# EAGLE design Arduino Nano2 (EAGLE 5.11)
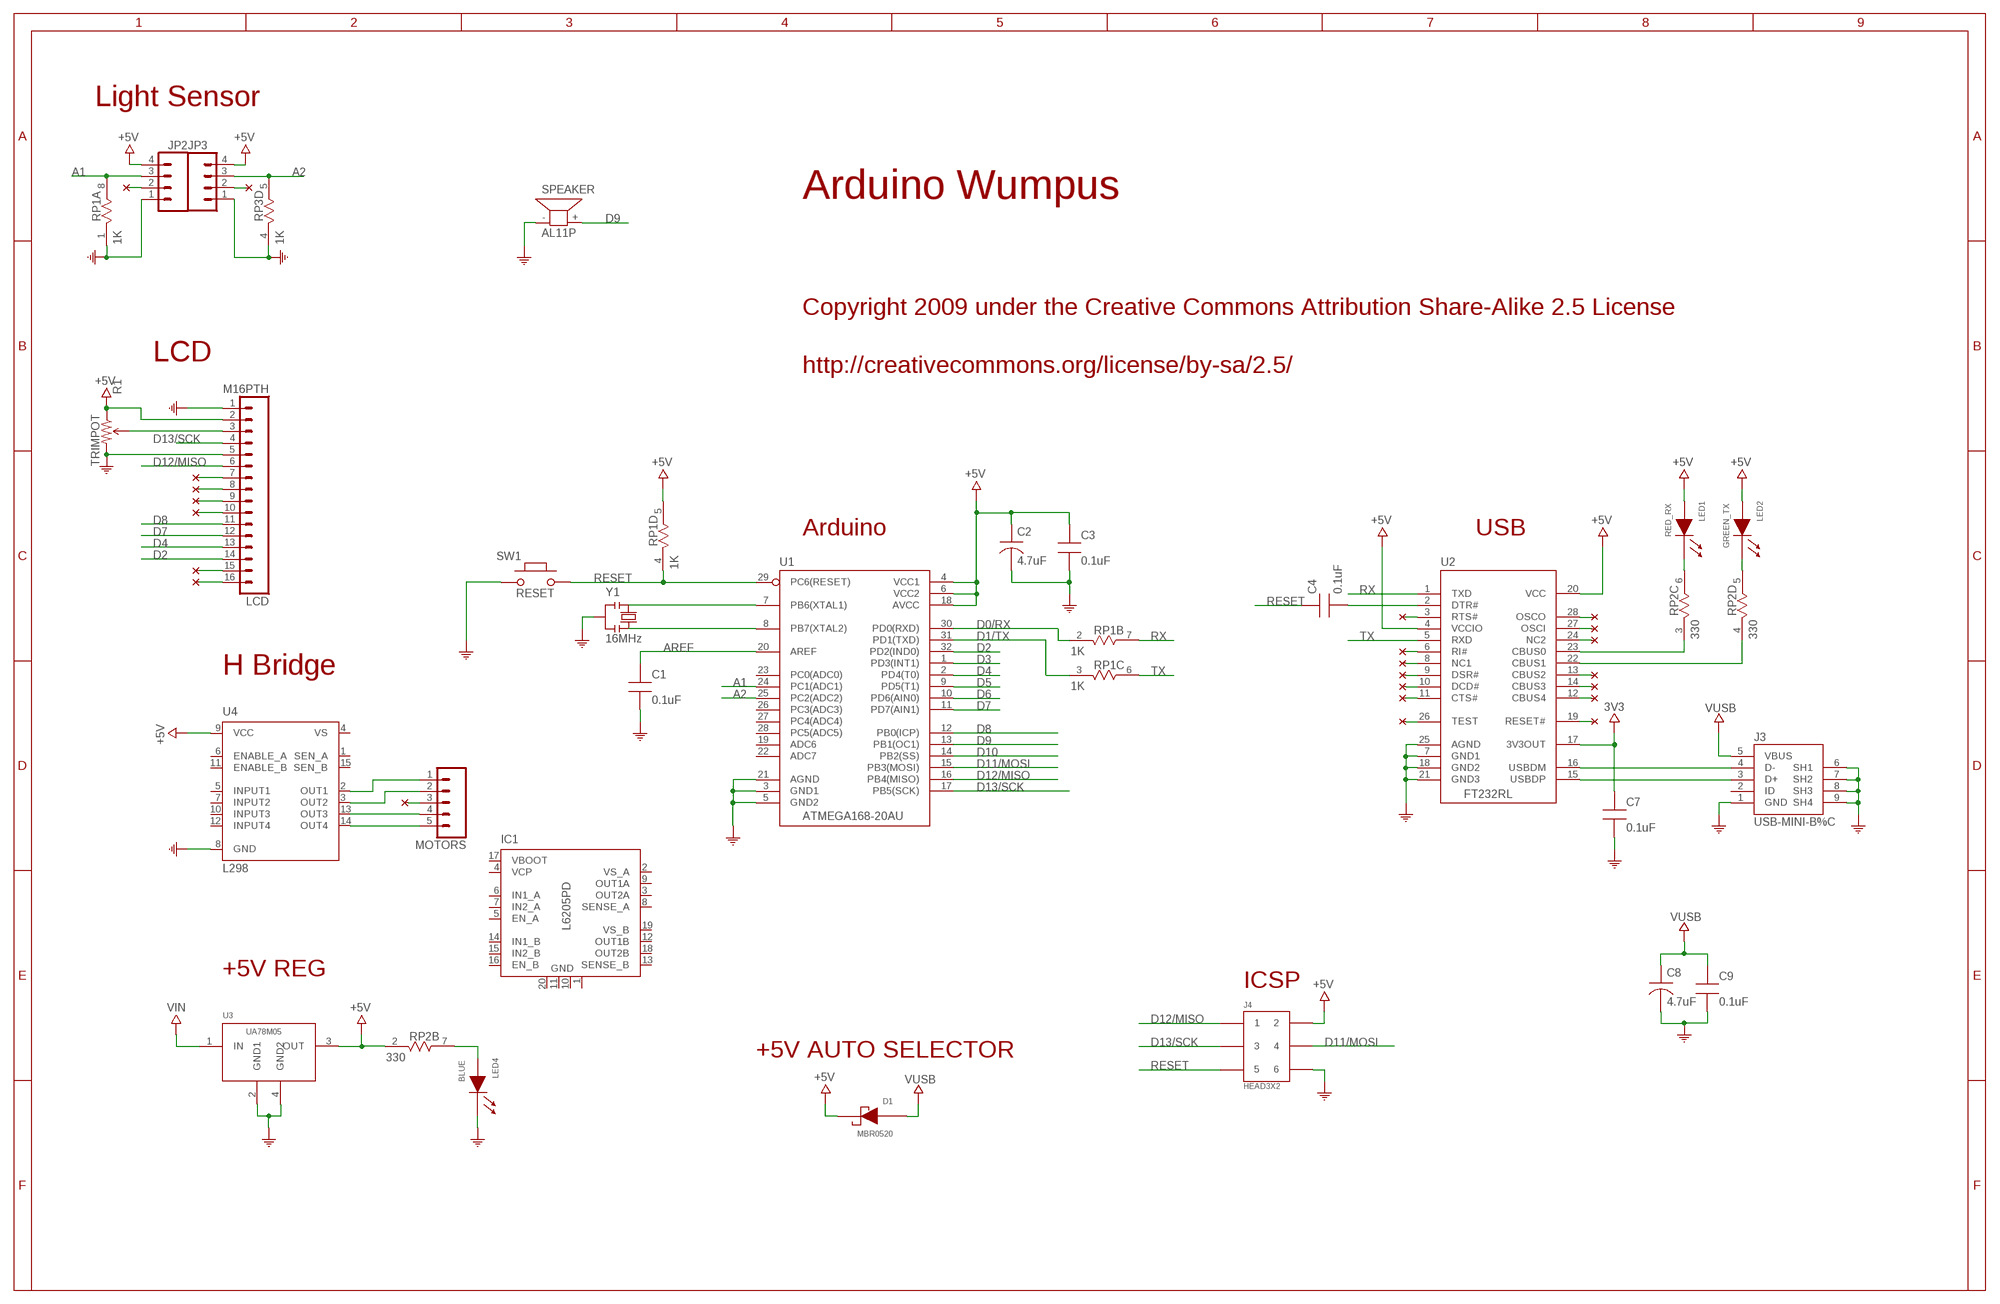
[diagram p0: schematic, sheet 1]

## Parts
C1  0.1uF  CAP0805-NP  [CAP0805-NP]
C2  4.7uF  CAP-TANA-P  [TAN-A]
C3  0.1uF  CAP0805-NP  [CAP0805-NP]
C4  0.1uF  CAP0805-NP  [CAP0805-NP]
C7  0.1uF  CAP0805-NP  [CAP0805-NP]
C8  4.7uF  CAP-TANA-P  [TAN-A]
C9  0.1uF  CAP0805-NP  [CAP0805-NP]
D1  MBR0520  [SOD-123]
IC1  L6205PD  [POWERSO-20]
J3  USB-MINI-B%C  [USB-MINI-B_2]
J4  HEAD3X2  [HEAD3X2]
JP2  M04PTH  [1X04]
JP3  M04PTH  [1X04]
LCD  M16PTH  [1X16]
LED1  RED_RX  LED0805  [LED0805]
LED2  GREEN_TX  LED0805  [LED0805]
LED4  BLUE  LED0805  [LED0805]
MOTORS  M05PTH  [1X05]
R1  TRIMPOT  [3362U-2]
RP1  1K  RES4NT  [RES4NT]
RP2  330  RES4NT  [RES4NT]
RP3  1K  RES4NT  [RES4NT]
SPEAKER  AL11P  [AL11P]
SW1  RESET  PB157  [157SW]
U1  ATMEGA168-20AU  [QFP032]
U2  FT232RL  [SSOP28]
U3  UA78M05  [SOT223]
U4  L298  [MULTIWATT-15]
Y1  16MHz  RESONATORMU  [RESONATOR]

## Nets
3V3: C7.1 U2.17(3V3OUT)
+5V: C2.1 C3.1 D1.1(CA) J4.2 JP2.4 JP3.4 LCD.2 LED1.2(AN) LED2.2(AN) R1.1(CCW) RP1.5 RP2.2 U1.4(VCC1) U1.6(VCC2) U1.18(AVCC) U2.4(VCCIO) U2.20(VCC) U3.3(OUT) U4.9(VCC)
A1: JP2.3 RP1.8 U1.24(PC1(ADC1))
A2: JP3.3 RP3.5 U1.25(PC2(ADC2))
AREF: C1.1 U1.20(AREF)
COM: C1.2 C2.2 C3.2 C7.2 C8.2 C9.2 J3.1(GND) J3.6(SH1) J3.7(SH2) J3.8(SH3) J3.9(SH4) J4.6 JP2.1 JP3.1 LCD.1 LCD.5 LED4.1(CA) R1.3(CW) RP1.1 RP3.4 SPEAKER.- SW1.1 U1.3(GND1) U1.5(GND2) U1.21(AGND) U2.7(GND1) U2.18(GND2) U2.21(GND3) U2.25(AGND) U3.2(GND1) U3.4(GND2) U4.8(GND) Y1.2
D0/RX: RP1.2 U1.30(PD0(RXD))
D1/TX: RP1.3 U1.31(PD1(TXD))
D2: LCD.14 U1.32(PD2(IND0))
D3: U1.1(PD3(INT1))
D4: LCD.13 U1.2(PD4(T0))
D5: U1.9(PD5(T1))
D6: U1.10(PD6(AIN0))
D7: LCD.12 U1.11(PD7(AIN1))
D8: LCD.11 U1.12(PB0(ICP))
D9: SPEAKER.+ U1.13(PB1(OC1))
D10: U1.14(PB2(SS))
D11/MOSI: J4.4 U1.15(PB3(MOSI))
D12/MISO: J4.1 LCD.6 U1.16(PB4(MISO))
D13/SCK: J4.3 LCD.4 U1.17(PB5(SCK))
N$1: U1.8(PB7(XTAL2)) Y1.3
N$2: U1.7(PB6(XTAL1)) Y1.1
N$3: LED4.2(AN) RP2.7
N$4: C4.2 U2.2(DTR#)
N$5: J3.3(D+) U2.15(USBDP)
N$6: J3.4(D-) U2.16(USBDM)
N$7: LCD.7
N$8: RP2.3 U2.23(CBUS0)
N$9: RP2.4 U2.22(CBUS1)
N$10: LED1.1(CA) RP2.6
N$11: LED2.1(CA) RP2.5
N$12: U2.11(CTS#)
N$13: U2.6(RI#)
N$14: U2.8(NC1)
N$15: U2.9(DSR#)
N$16: U2.10(DCD#)
N$17: U2.28(OSCO)
N$18: U2.27(OSCI)
N$19: U2.24(NC2)
N$20: U2.13(CBUS2)
N$21: U2.14(CBUS3)
N$22: U2.12(CBUS4)
N$23: U2.19(RESET#)
N$26: U2.26(TEST)
N$27: U2.3(RTS#)
N$28: LCD.8
N$29: LCD.9
N$30: LCD.3 R1.2(WIPER)
N$31: MOTORS.1 U4.2(OUT1)
N$32: MOTORS.2 U4.3(OUT2)
N$33: MOTORS.4 U4.13(OUT3)
N$34: MOTORS.5 U4.14(OUT4)
N$35: LCD.10
N$36: LCD.15
N$37: LCD.16
N$39: JP3.2
N$40: JP2.2
N$42: MOTORS.3
RESET: C4.1 J4.5 RP1.4 SW1.2 U1.29(PC6(RESET))
RX: RP1.7 U2.1(TXD)
TX: RP1.6 U2.5(RXD)
VIN: U3.1(IN)
VUSB: C8.1 C9.1 D1.2(AN) J3.5(VBUS)
Unconnected: IC1.3(OUT2A) IC1.5(EN_A) IC1.6(IN1_A) IC1.7(IN2_A) IC1.8(SENSE_A) IC1.9(OUT1A) IC1.12(OUT1B) IC1.13(SENSE_B) IC1.14(IN1_B) IC1.15(IN2_B) IC1.16(EN_B) IC1.18(OUT2B) J3.2(ID) RP2.1 RP2.8 RP3.1 RP3.2 RP3.3 RP3.6 RP3.7 RP3.8 U1.19(ADC6) U1.22(ADC7) U1.23(PC0(ADC0)) U1.26(PC3(ADC3)) U1.27(PC4(ADC4)) U1.28(PC5(ADC5)) U4.1(SEN_A) U4.5(INPUT1) U4.6(ENABLE_A) U4.7(INPUT2) U4.10(INPUT3) U4.11(ENABLE_B) U4.12(INPUT4) U4.15(SEN_B)

## Notes on the sheet
- Light Sensor
- Arduino Wumpus
- Copyright 2009 under the Creative Commons Attribution Share-Alike 2.5 License
- LCD
- http://creativecommons.org/license/by-sa/2.5/
- Arduino | USB
- H Bridge
- +5V REG
- ICSP
- +5V AUTO SELECTOR

## Power pins joined to a net without a drawn wire
GND: IC1.1(GND) IC1.10(GND) IC1.11(GND) IC1.20(GND)
VBOOT: IC1.17(VBOOT)
VCP: IC1.4(VCP)
VS: U4.4(VS)
VS_A: IC1.2(VS_A)
VS_B: IC1.19(VS_B)

## Library data of the parts
C1 C3 C4 C7 C9 = MySMD:CAP0805-NP
C2 C8 = MySMD:CAP-TANA-P
D1 = MySMD:MBR0520
IC1 = st-microelectronics:L6205: DUAL DMOS FULL BRIDGE MOTOR DRIVER; MF: Arrow Electronics; MPN: L6205PD; OC_FARNELL: unknown; OC_NEWARK: 89K0755
J3 = MyCON2:USB-MINI-B
J4 = MyCON2:HEAD3X2
JP2 JP3 = SparkFun:M04: Header 4 Standard 4-pin 0.1" header. Use with straight break away headers (SKU : PRT-00116), right angle break away headers (PRT-00553), swiss pins (PRT-00743), machine pins (PRT-00117), and female headers (PRT-00115). Molex polarized connector foot print use with SKU : PRT-08231 with associated crimp pins and housings. 1MM SMD Version SKU: PRT-10208
LCD = SparkFun:M16
LED1 LED2 LED4 = MySMD:LED0805
MOTORS = SparkFun:M05: Header 5 Standard 5-pin 0.1" header. Use with straight break away headers (SKU : PRT-00116), right angle break away headers (PRT-00553), swiss pins (PRT-00743), machine pins (PRT-00117), and female headers (PRT-00115). Molex polarized connector foot print use with SKU : PRT-08230 with associated crimp pins and housings.
R1 = SparkFun:TRIMPOT
RP1-RP3 = MySMD:RES4NT
SPEAKER = buzzer:AL11P: SPEAKER Source: Buerklin; OC_FARNELL: unknown; OC_NEWARK: unknown
SW1 = MySMD:PB157
U1 = MySMD:ATMEGA168-20AU
U2 = MySMD2:FT232RL
U3 = MySMD:UA78M05
U4 = st-microelectronics:L298: DUAL FULL-BRIDGE DRIVER; MPN: L298N; OC_FARNELL: 1589425; OC_NEWARK: 32M1527
Y1 = MySMD2:RESONATOR

## Board
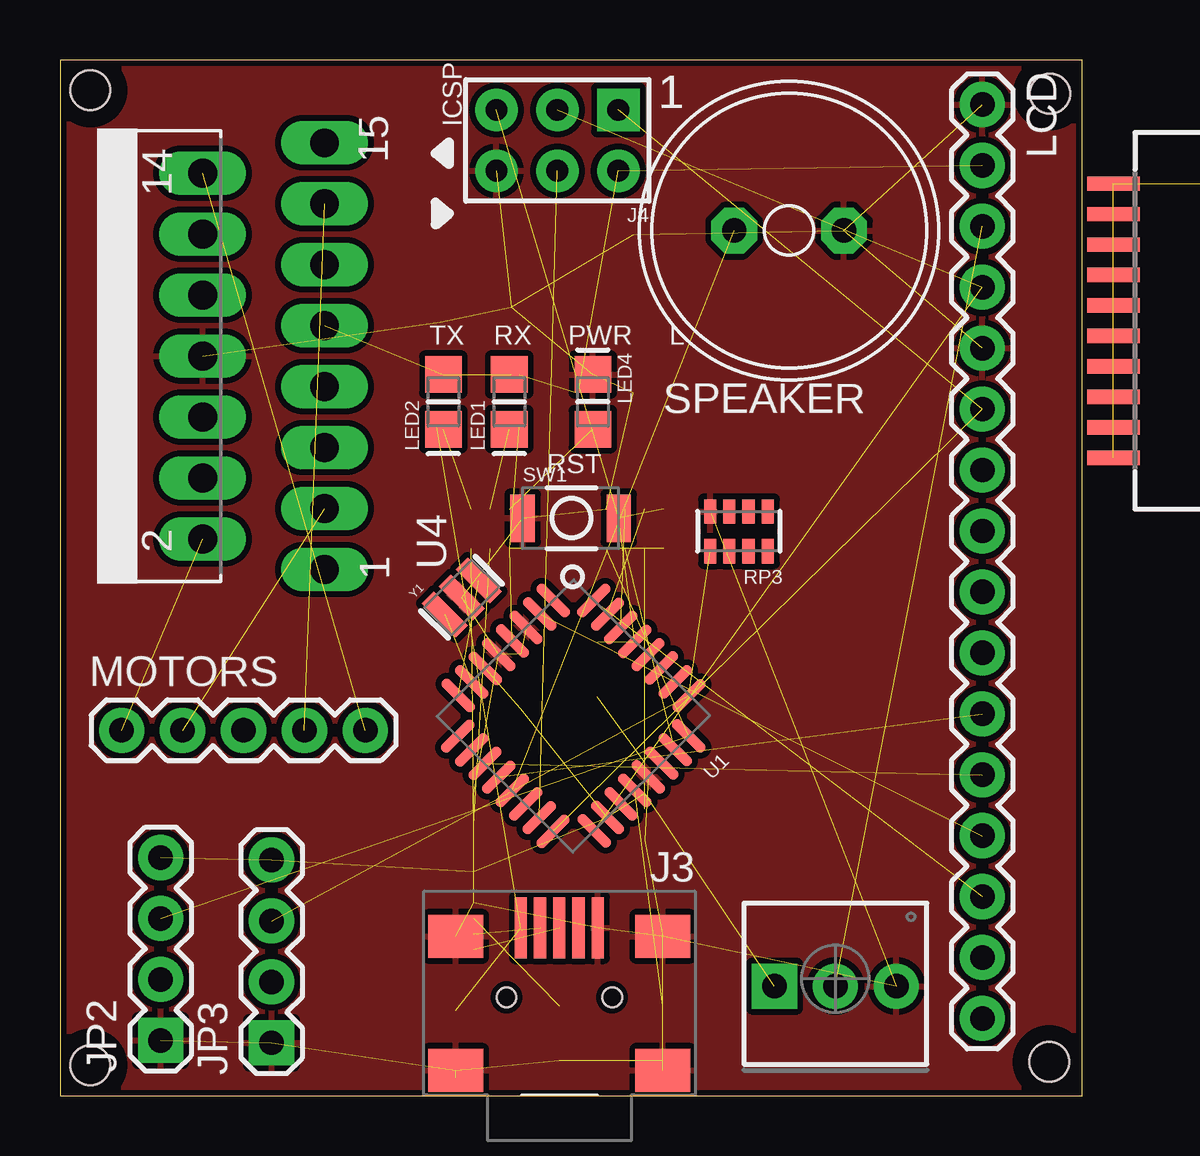
[diagram p1: board, top side]
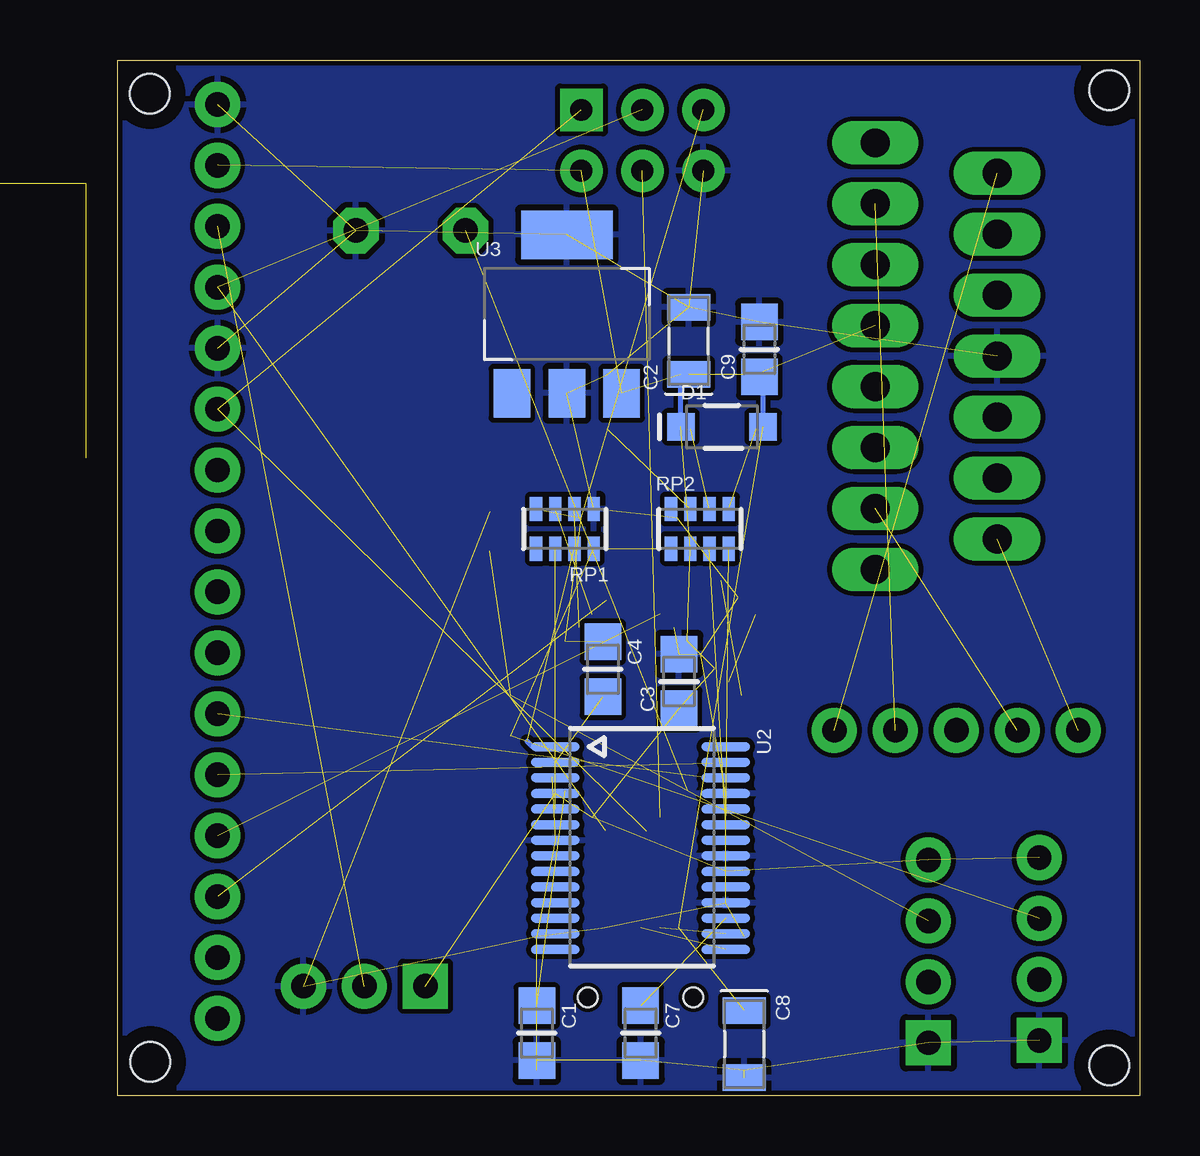
[diagram p2: board, bottom side, seen from below]

Size 42.6 x 43.18 mm. Coordinates in mm from the lower left corner, seen from the top.
Outline: 0,0 42.6,0 42.6,43.18 0,43.18 0,0
Copper layers (1*16): Top 0.035mm / dielectric 1.5mm / Bottom 0.035mm
Design rules "default *": minimum track width 8mil, minimum drill 16mil, track to track 8mil, track to pad 8mil, pad to pad 8mil, via to via 8mil, smd to smd 8mil, copper to edge 8mil, drill to drill 8mil, minimum pad ring 12mil, minimum via ring 8mil, stop-mask expansion 4mil, vias tented up to drill 18mil, thermal gap 10mil
Holes 1.65 mm at 1.27,1.27 41.22,1.42 41.25,41.78 1.27,41.91
tRestrict: area 0.1,0.1 to 2.4,2.4; area 40.1,40.6 to 42.4,42.9; area 40.1,0.3 to 42.4,2.6; area 0.1,40.8 to 2.4,43.1
bRestrict: area 40.1,0.3 to 42.4,2.6; area 0.1,0.1 to 2.4,2.4; area 0.1,40.8 to 2.4,43.1; area 40.1,40.6 to 42.4,42.9

### Footprints (pad centres in the part's own frame; a part is rotated, then mirrored left to right if it is on the bottom)
CAP0805-NP = smd 1.524 x 1.524: 1 0,0; 2 2.286,0
TAN-A = smd 1.118 x 1.778: 1 0,0; 2 2.794,0
SOD-123 = smd 1.143 x 1.143: 1 0,0; 2 3.429,0
POWERSO-20 = smd 0.6 x 2.2: 1 -5.715,-6.5; 2 -4.445,-6.5; 3 -3.175,-6.5; 4 -1.905,-6.5; 5 -0.635,-6.5; 6 0.635,-6.5; 7 1.905,-6.5; 8 3.175,-6.5; 9 4.445,-6.5; 10 5.715,-6.5; 11 5.715,6.5; 12 4.445,6.5; 13 3.175,6.5; 14 1.905,6.5; 15 0.635,6.5; 16 -0.635,6.5; 17 -1.905,6.5; 18 -3.175,6.5; 19 -4.445,6.5; 20 -5.715,6.5
USB-MINI-B_2 = smd 0.508 x 2.54: 1 0,0; 2 0.8,0; 3 1.6,0; 4 2.4,0; 5 3.2,0 | smd 2.286 x 1.778: 6 -2.717,5.948; 7 -2.717,0.36; 8 5.918,0.36; 9 5.918,5.948 | hole 0.813: -0.6,2.9; 3.8,2.9
HEAD3X2 = drill 0.914 pad 1.778 square: 1 0,0 | drill 0.914 pad 1.778 round: 2 0,2.54; 3 2.54,0; 4 2.54,2.54; 5 5.08,0; 6 5.08,2.54
1X04 = drill 1.016 pad 1.88 square: 1 0,0 | drill 1.016 pad 1.88 round: 2 2.54,0; 3 5.08,0; 4 7.62,0
1X16 = drill 1.016 pad 1.88 round: 1 0,0; 2 2.54,0; 3 5.08,0; 4 7.62,0; 5 10.16,0; 6 12.7,0; 7 15.24,0; 8 17.78,0; 9 20.32,0; 10 22.86,0; 11 25.4,0; 12 27.94,0; 13 30.48,0; 14 33.02,0; 15 35.56,0; 16 38.1,0
LED0805 = smd 1.524 x 1.524: 1 0,0; 2 2.286,0
1X05 = drill 1.016 pad 1.88 round: 1 0,0; 2 2.54,0; 3 5.08,0; 4 7.62,0; 5 10.16,0
3362U-2 = drill 1.016 pad 1.88 square: 1 -2.54,-0.305 | drill 1.016 pad 1.88 round: 2 0,-0.305; 3 2.54,-0.305
RES4NT = smd 0.508 x 1.016: 1 0,0; 2 0.8,0; 3 1.6,0; 4 2.4,0; 5 2.4,1.651; 6 1.6,1.651; 7 0.8,1.651; 8 0,1.651
AL11P = drill 1.016 pad 1.905 octagon: + 2.286,0; - -2.286,0
157SW = smd 1.016 x 1.981: 1 0,0; 2 4,0
QFP032 = smd 0.432 x 1.778: 1 0,0; 2 0.8,0; 3 1.599,0; 4 2.399,0; 5 3.199,0; 6 3.998,0; 7 4.798,0; 8 5.598,0; 17 5.588,8.001; 18 4.798,7.997; 19 3.998,7.997; 20 3.199,7.997; 21 2.399,7.997; 22 1.599,7.997; 23 0.799,7.997; 24 0,7.997 | smd 1.778 x 0.432: 9 6.807,1.194; 10 6.807,2.007; 11 6.807,2.794; 12 6.807,3.607; 13 6.807,4.394; 14 6.807,5.182; 15 6.807,5.994; 16 6.816,6.803; 25 -1.194,6.807; 26 -1.194,5.994; 27 -1.194,5.182; 28 -1.194,4.394; 29 -1.194,3.607; 30 -1.194,2.794; 31 -1.194,2.007; 32 -1.194,1.194
SSOP28 = smd 0.381 x 2.032: 1 0,0; 2 0.65,0; 3 1.3,0; 4 1.95,0; 5 2.6,0; 6 3.25,0; 7 3.9,0; 8 4.55,0; 9 5.2,0; 10 5.85,0; 11 6.5,0; 12 7.15,0; 13 7.8,0; 14 8.45,0; 15 8.45,7.112; 16 7.8,7.112; 17 7.15,7.112; 18 6.5,7.112; 19 5.85,7.112; 20 5.2,7.112; 21 4.55,7.112; 22 3.9,7.112; 23 3.25,7.112; 24 2.6,7.112; 25 1.95,7.112; 26 1.3,7.112; 27 0.65,7.112; 28 0,7.112
SOT223 = smd 1.524 x 2.032: 1 0,0; 2 2.286,0; 3 4.572,0 | smd 3.81 x 2.032: 4 2.286,6.604
MULTIWATT-15 = drill 1.2 long: 1 -8.89,-7.62; 2 -7.62,-2.54; 3 -6.35,-7.62; 4 -5.08,-2.54; 5 -3.81,-7.62; 6 -2.54,-2.54; 7 -1.27,-7.62; 8 0,-2.54; 9 1.27,-7.62; 10 2.54,-2.54; 11 3.81,-7.62; 12 5.08,-2.54; 13 6.35,-7.62; 14 7.62,-2.54; 15 8.89,-7.62
RESONATOR = smd 0.7 x 2: 1 -1,0; 2 0,0; 3 1,0

### Placement (x,y rotation side)
C1  25.12,3.76 270 bottom
C2  18.8,30.07 90 bottom
C3  19.2,16.13 90 bottom
C4  22.38,18.92 270 bottom
C7  20.8,3.76 270 bottom
C8  16.48,3.56 270 bottom
C9  15.85,29.97 90 bottom
D1  19.13,27.89 0 bottom
IC1  50.39,32.31 90 top
J3  22.4,7.01 180 top
J4  23.27,41.1 180 top
JP2  4.19,2.31 90 top
JP3  8.81,2.21 90 top
LCD  38.43,41.33 270 top
LED1  18.72,27.79 90 top
LED2  15.98,27.79 90 top
LED4  22.2,30.07 270 top
MOTORS  2.57,15.24 0 top
R1  32.31,4.88 0 top
RP1  22.76,24.46 180 bottom
RP2  19.53,22.81 0 bottom
RP3  29.49,24.36 180 top
SPEAKER  30.38,36.07 180 top
SW1  19.28,24.08 0 top
U1  20.55,20.65 225 top
U2  24.36,14.55 270 bottom
U3  26.16,29.29 0 bottom
U4  3.4,30.84 90 top
Y1  16.74,20.78 45 top

### Tracks (layer width: path | path; a pad name or v marks a point on that pad's centre or on a via)
3V3  (1 unrouted)
+5V  (17 unrouted)
  Bottom 0.203: D1.1 19.13,30.07 C2.1
A1  (2 unrouted)
A2  (2 unrouted)
AREF  (1 unrouted)
COM  (32 unrouted)
  pour Top (isolate 0.254): 0.25,0.25 0.25,42.93 42.32,42.93 42.32,0.25
  pour Bottom (isolate 0.203): 0.25,0.25 0.25,42.93 42.32,42.93 42.32,0.25
D0/RX  (1 unrouted)
D1/TX  (1 unrouted)
D2  (1 unrouted)
D4  (1 unrouted)
D7  (1 unrouted)
D8  (1 unrouted)
D9  (1 unrouted)
D11/MOSI  (1 unrouted)
D12/MISO  (2 unrouted)
D13/SCK  (2 unrouted)
GND  (3 unrouted)
N$1  (1 unrouted)
N$2  (1 unrouted)
N$3  (1 unrouted)
N$4  (1 unrouted)
N$5  (1 unrouted)
N$6  (1 unrouted)
N$8  (1 unrouted)
  Bottom 0.254: U2.23
N$9  (1 unrouted)
N$10  (1 unrouted)
  Top 0.254: LED1.1 18.72,27.81
N$11  (1 unrouted)
N$30  (1 unrouted)
N$31  (1 unrouted)
N$32  (1 unrouted)
N$33  (1 unrouted)
N$34  (1 unrouted)
RESET  (4 unrouted)
RX  (1 unrouted)
  Bottom 0.203: 25.53,14.78 25.3,14.55 U2.1
TX  (1 unrouted)
VUSB  (2 unrouted)
  Bottom 0.203: D1.2 15.7,29.97 C9.1

### Text on the board
tPlace: 1 | ICSP | TX | RX | PWR | L | RST